# EAGLE design Ananas-core-0.9.2 (EAGLE 7.2.0)
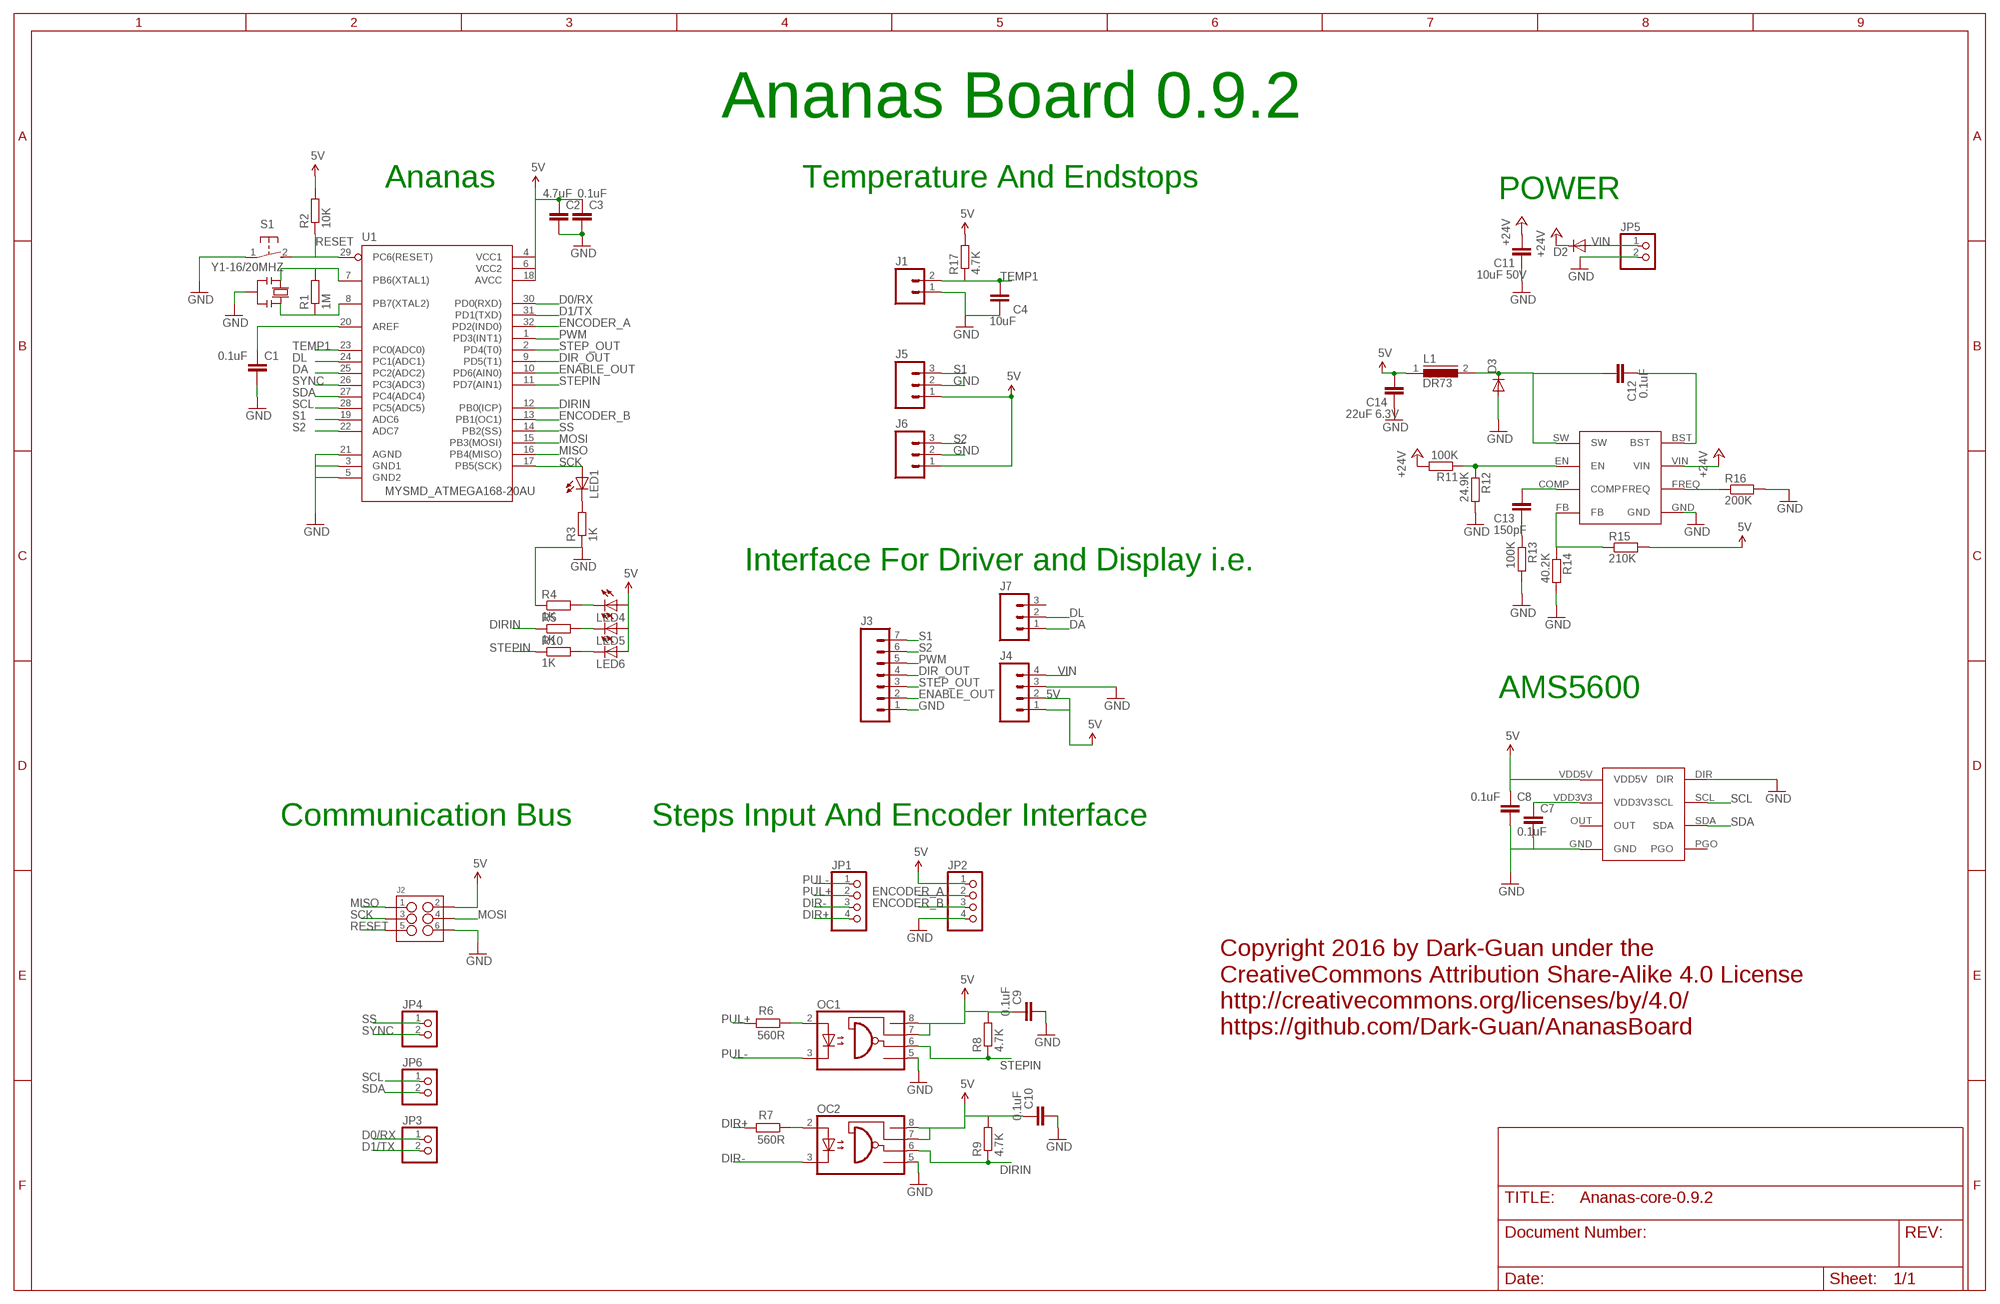
[diagram p0: schematic, sheet 1]

## Parts
C1  0.1uF  C-EUC0603K  [C0603K]
C2  4.7uF  C-EUC0603K  [C0603K]
C3  0.1uF  C-EUC0603K  [C0603K]
C4  10uF  C-EUC0603K  [C0603K]
C7  0.1uF  C-EUC0603K  [C0603K]
C8  0.1uF  C-EUC0603K  [C0603K]
C9  0.1uF  C-EUC0603K  [C0603K]
C10  0.1uF  C-EUC0603K  [C0603K]
C11  10uF 50V  C-EUC0805  [C0805]
C12  0.1uF  C-EUC0603K  [C0603K]
C13  150pF  C-EUC0603K  [C0603K]
C14  22uF 6.3V  C-EUC0805  [C0805]
D2  DIODE_DIODE-SMB  [DIODE_SMB]
D3  DIODE_DIODE-SMB  [DIODE_SMB]
J1  M02PTH  [1X02]
J2  M03X2NO_SILK  [2X3-NS]
J3  M07  [1X07]
J4  M04PTH  [1X04]
J5  M03PTH  [1X03]
J6  M03PTH  [1X03]
J7  M03PTH  [1X03]
JP1  PINHD-1X4/OCT  [1X04/OCT]
JP2  PINHD-1X4/OCT  [1X04/OCT]
JP3  PINHD-1X2/OCT  [1X02/OCT]
JP4  PINHD-1X2/OCT  [1X02/OCT]
JP5  PINHD-1X2/OCT  [1X02/OCT]
JP6  PINHD-1X2/OCT  [1X02/OCT]
L1  DR73  [DR73]
LED1  LEDCHIPLED_0603  [CHIPLED_0603]
LED4  LEDCHIPLED_0603  [CHIPLED_0603]
LED5  LEDCHIPLED_0603  [CHIPLED_0603]
LED6  LEDCHIPLED_0603  [CHIPLED_0603]
MP1854  MP1584  [MP1584]
OC1  OPTOCOUPLER_(2)_HCPL0600  [OPTOCOUPLER_(2)_SOIC08]
OC2  OPTOCOUPLER_(2)_HCPL0600  [OPTOCOUPLER_(2)_SOIC08]
R1  1M  R-EU_R0603  [R0603]
R2  10K  R-EU_R0603  [R0603]
R3  1K  R-EU_R0603  [R0603]
R4  1K  R-EU_R0603  [R0603]
R5  1K  R-EU_R0603  [R0603]
R6  560R  R-EU_R0603  [R0603]
R7  560R  R-EU_R0603  [R0603]
R8  4.7K  R-EU_R0603  [R0603]
R9  4.7K  R-EU_R0603  [R0603]
R10  1K  R-EU_R0603  [R0603]
R11  100K  R-EU_R0603  [R0603]
R12  24.9K  R-EU_R0603  [R0603]
R13  100K  R-EU_R0603  [R0603]
R14  40.2K  R-EU_R0603  [R0603]
R15  210K  R-EU_R0603  [R0603]
R16  200K  R-EU_R0603  [R0603]
R17  4.7K  R-EU_R0603  [R0603]
S1  31-XX  [B3F-31XX]
U1  MYSMD_ATMEGA168-20AU  [MYSMD_QFP032]
U$1  ARDUINO_AS5600  [ARDUINO_AS5600]
Y1-16/20MHZ  MYSMD2_RESONATORMU  [MYSMD2_RESONATOR]

## Nets
5V: C2.1 C3.1 C8.1 C9.1 C10.1 C14.2 J2.2 J4.1 J4.2 J5.1 J6.1 JP2.1 L1.1 LED4.A LED5.A LED6.A OC1.7(VE) OC1.8(VCC) OC2.7(VE) OC2.8(VCC) R2.2 R8.2 R9.2 R15.2 R17.2 U1.4(VCC1) U1.6(VCC2) U1.18(AVCC) U$1.VDD5V
+24V: C11.2 D2.C MP1854.VIN R11.2
D0/RX: JP3.1 U1.30(PD0(RXD))
D1/TX: JP3.2 U1.31(PD1(TXD))
DA: J7.1 U1.25(PC2(ADC2))
DIR+: JP1.4 R7.2
DIR-: JP1.3 OC2.3(C)
DIR_OUT: J3.4 U1.9(PD5(T1))
DIRIN: OC2.6(VO) R5.1 R9.1 U1.12(PB0(ICP))
DL: J7.2 U1.24(PC1(ADC1))
ENABLE_OUT: J3.2 U1.10(PD6(AIN0))
ENCODER_A: JP2.2 U1.32(PD2(IND0))
ENCODER_B: JP2.3 U1.13(PB1(OC1))
GND: C1.2 C2.2 C3.2 C4.1 C7.2 C8.2 C9.2 C10.2 C11.1 C14.1 D3.A J1.1 J2.6 J3.1 J4.3 J5.2 J6.2 JP2.4 JP5.2 MP1854.GND OC1.5(GND) OC2.5(GND) R3.1 R4.1 R12.2 R13.2 R14.2 R16.2 S1.1(P) U1.3(GND1) U1.5(GND2) U1.21(AGND) U$1.DIR U$1.GND Y1-16/20MHZ.2
MISO: J2.1 U1.16(PB4(MISO))
MOSI: J2.4 U1.15(PB3(MOSI))
N$3: R1.2 U1.7(PB6(XTAL1)) Y1-16/20MHZ.1
N$4: R1.1 U1.8(PB7(XTAL2)) Y1-16/20MHZ.3
N$7: C1.1 U1.20(AREF)
N$9: OC1.2(A) R6.1
N$10: LED1.C R3.2
N$11: OC2.2(A) R7.1
N$13: C13.1 R13.1
N$14: C7.1 U$1.VDD3V3
N$16: MP1854.FREQ R16.1
N$17: C12.1 MP1854.BST
N$18: C12.2 D3.C L1.2 MP1854.SW
N$19: MP1854.EN R11.1 R12.1
N$20: C13.2 MP1854.COMP
N$21: MP1854.FB R14.1 R15.1
N$25: LED4.C R4.2
N$26: LED5.C R5.2
N$27: LED6.C R10.2
PUL+: JP1.2 R6.2
PUL-: JP1.1 OC1.3(C)
PWM: J3.5 U1.1(PD3(INT1))
RESET: J2.5 R2.1 S1.2(S) U1.29(PC6(RESET))
S1: J3.7 J5.3 U1.19(ADC6)
S2: J3.6 J6.3 U1.22(ADC7)
SCK: J2.3 LED1.A U1.17(PB5(SCK))
SCL: JP6.1 U1.28(PC5(ADC5)) U$1.SCL
SDA: JP6.2 U1.27(PC4(ADC4)) U$1.SDA
SS: JP4.1 U1.14(PB2(SS))
STEP_OUT: J3.3 U1.2(PD4(T0))
STEPIN: OC1.6(VO) R8.1 R10.1 U1.11(PD7(AIN1))
SYNC: JP4.2 U1.26(PC3(ADC3))
TEMP1: C4.2 J1.2 R17.1 U1.23(PC0(ADC0))
VIN: D2.A J4.4 JP5.1
Unconnected: J7.3 U$1.OUT U$1.PGO

## Notes on the sheet
- Ananas Board 0.9.2
- Ananas | Temperature And Endstops
- POWER
- Interface For Driver and Display i.e.
- AMS5600
- Communication Bus | Steps Input And Encoder Interface
- Copyright 2016 by Dark-Guan under the
  CreativeCommons Attribution Share-Alike 4.0 License
  http://creativecommons.org/licenses/by/4.0/
  https://github.com/Dark-Guan/AnanasBoard

## Library data of the parts
C1-C4 C7-C14 = resistor:C-EU: CAPACITOR, European symbol
D2 D3 = Arduino_MEGA2560_ref:DIODE_DIODE-: DIODE
J1 = SparkFun-Connectors:M02: Standard 2-pin 0.1" header. Use with - straight break away headers ( PRT-00116) - right angle break away headers (PRT-00553) - swiss pins (PRT-00743) - machine pins (PRT-00117) - female headers (PRT-00115) Molex polarized connector foot print use with: PRT-08233 with associated crimp pins and housings. 2.54_SCREWTERM for use with PRT-10571. 3.5mm Screw Terminal footprints for PRT-08084 5mm Screw Terminal footprints for use with PRT-08432
J2 = SparkFun-Connectors:M03X2: 2x3 .1" header. Shrouded, with keying- CONN-10681 SMT- CONN-11415 Pogo pins- HW-11044
J3 = SparkFun-Connectors:M07: Header 7 Standard 7-pin 0.1" header. Use with straight break away headers (SKU : PRT-00116), right angle break away headers (PRT-00553), swiss pins (PRT-00743), machine pins (PRT-00117), and female headers (PRT-00115). NOTES ON THE VARIANTS LOCK and LOCK_LONGPADS... This footprint was designed to help hold the alignment of a through-hole component (i.e. 7-pin header) while soldering it into place. You may notice that each hole has been shifted either up or down by 0.005 of an inch from it's more standard position (which is usually a perfectly straight line). This slight alteration caused the pins (the squares in the middle) to touch the edges of the holes. Because they are alternating, it causes a "brace" to hold the header in place. 0.005 has proven to be the perfect amount of "off-center" position when using our standard breakaway headers. Although looks a little odd when you look at the bare footprint, once you have a header in there, the alteration is very hard to notice. Also, if you push a header all the way into place, it is covered up entirely on the bottom side. This idea of altering the position of holes to aid alignment will be further integrated into the Sparkfun Library for other footprints. It can help hold any component with 3 or more connection pins.
J4 = SparkFun-Connectors:M04: Header 4 Standard 4-pin 0.1" header. Use with straight break away headers (SKU : PRT-00116), right angle break away headers (PRT-00553), swiss pins (PRT-00743), machine pins (PRT-00117), and female headers (PRT-00115). Molex polarized connector foot print use with SKU : PRT-08231 with associated crimp pins and housings. 1MM SMD Version SKU: PRT-10208; PROD_ID: CONN-09696
J5-J7 = SparkFun-Connectors:M03: Header 3 Standard 3-pin 0.1" header. Use with straight break away headers (SKU : PRT-00116), right angle break away headers (PRT-00553), swiss pins (PRT-00743), machine pins (PRT-00117), and female headers (PRT-00115). Molex polarized connector foot print use with SKU : PRT-08232 with associated crimp pins and housings.
JP1 JP2 = pinhead_v2:PINHD-1X4: PIN HEADER
JP3-JP6 = pinhead_v2:PINHD-1X2: PIN HEADER
L1 = inductors:DR73: High Power Density, High Efficiency, Shielded Inductors Source: coiltronics_dr_series.pdf
LED1 LED4-LED6 = led:LED: LED OSRAM: - CHIPLED LG R971, LG N971, LY N971, LG Q971, LY Q971, LO R971, LY R971 LH N974, LH R974 LS Q976, LO Q976, LY Q976 LO Q996 - Hyper CHIPLED LW Q18S LB Q993, LB Q99A, LB R99A - SideLED LS A670, LO A670, LY A670, LG A670, LP A670 LB A673, LV A673, LT A673, LW A673 LH A674 LY A675 LS A676, LA A676, LO A676, LY A676, LW A676 LS A679, LY A679, LG A679 - Hyper Micro SIDELED? LS Y876, LA Y876, LO Y876, LY Y876 LT Y87S - SmartLED LW L88C, LW L88S LB L89C, LB L89S, LG L890 LS L89K, LO L89K, LY L89K LS L896, LA L896, LO L896, LY L896 - TOPLED LS T670, LO T670, LY T670, LG T670, LP T670 LSG T670, LSP T670, LSY T670, LOP T670, LYG T670 LG T671, LOG T671, LSG T671 LB T673, LV T673, LT T673, LW T673 LH T674 LS T676, LA T676, LO T676, LY T676, LB T676, LH T676, LSB T676, LW T676 LB T67C, LV T67C, LT T67C, LS T67K, LO T67K, LY T67K, LW E67C LS E67B, LA E67B, LO E67B, LY E67B, LB E67C, LV E67C, LT E67C LW T67C LS T679, LY T679, LG T679 LS T770, LO T770, LY T770, LG T770, LP T770 LB T773, LV T773, LT T773, LW T773 LH T774 LS E675, LA E675, LY E675, LS T675 LS T776, LA T776, LO T776, LY T776, LB T776 LHGB T686 LT T68C, LB T68C - Hyper Mini TOPLED? LB M676 - Mini TOPLED Santana? LG M470 LS M47K, LO M47K, LY M47K Source: http://www.osram.convergy.de LUXEON: - LUMILED? LXK2-PW12-R00, LXK2-PW12-S00, LXK2-PW14-U00, LXK2-PW14-V00 LXK2-PM12-R00, LXK2-PM12-S00, LXK2-PM14-U00 LXK2-PE12-Q00, LXK2-PE12-R00, LXK2-PE12-S00, LXK2-PE14-T00, LXK2-PE14-U00 LXK2-PB12-K00, LXK2-PB12-L00, LXK2-PB12-M00, LXK2-PB14-N00, LXK2-PB14-P00, LXK2-PB14-Q00 LXK2-PR12-L00, LXK2-PR12-M00, LXK2-PR14-Q00, LXK2-PR14-R00 LXK2-PD12-Q00, LXK2-PD12-R00, LXK2-PD12-S00 LXK2-PH12-R00, LXK2-PH12-S00 LXK2-PL12-P00, LXK2-PL12-Q00, LXK2-PL12-R00 Source: www.luxeon.com KINGBRIGHT: KA-3528ASYC Source: www.kingbright.com
MP1854 = MP1584:MP1584
OC1 OC2 = Ananas-main:OPTOCOUPLER_(2)_HCPL0600: HEWLETT PACKARD OPTO COUPLER
R1-R17 = resistor:R-EU_: RESISTOR, European symbol
S1 = switch-omron:31-XX: OMRON SWITCH; MPN: B3F-3100; OC_FARNELL: 959704; OC_NEWARK: 36M3582
U1 = Arduino_Nano2:MYSMD_ATMEGA168-20AU
U$1 = Ananas-main:ARDUINO_AS5600
Y1-16/20MHZ = Arduino_Nano2:MYSMD2_RESONATOR

## Board
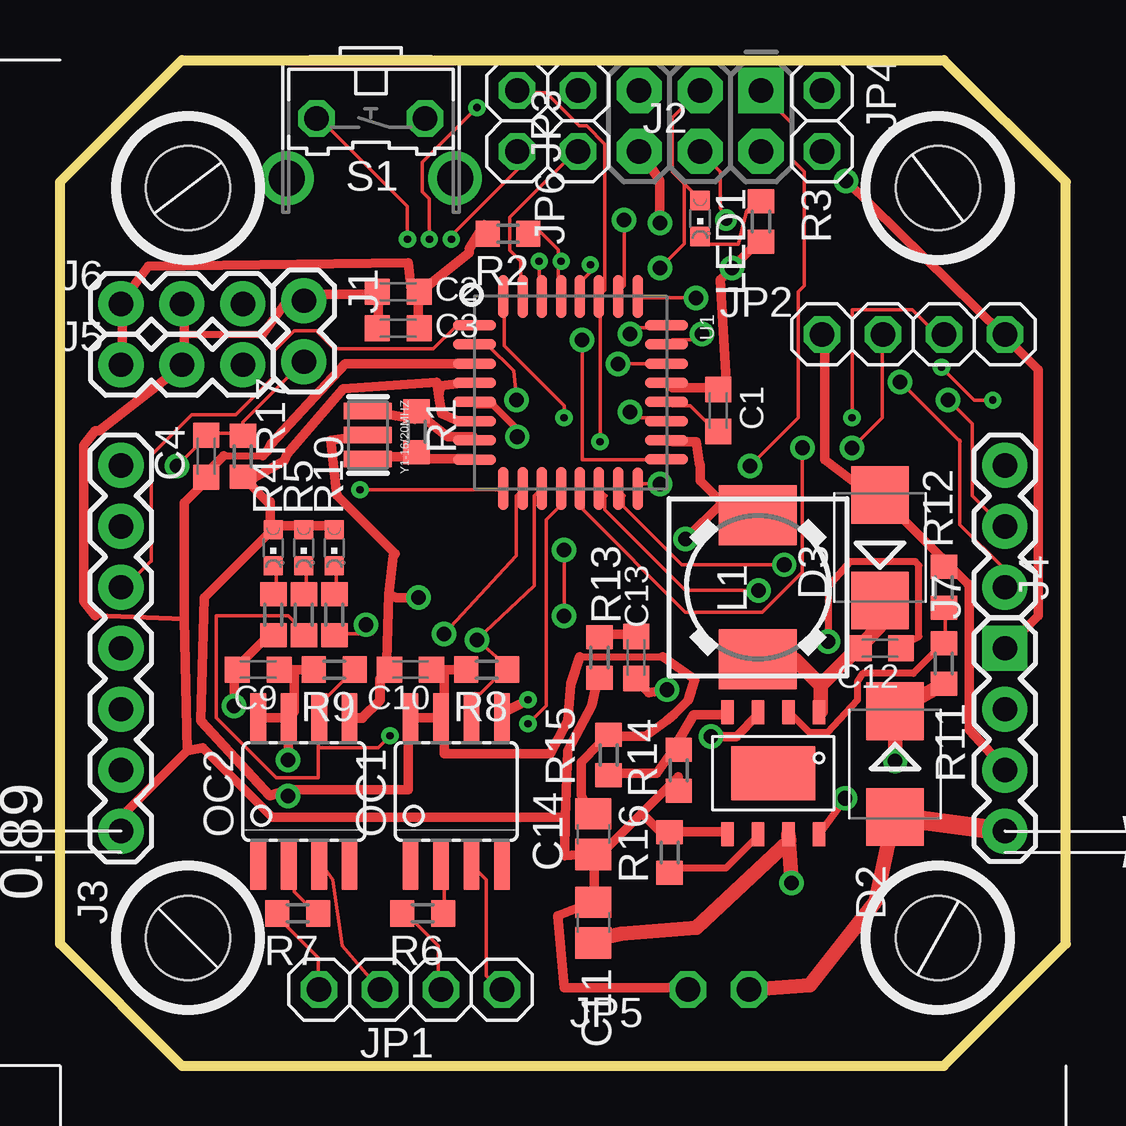
[diagram p1: board, top side]
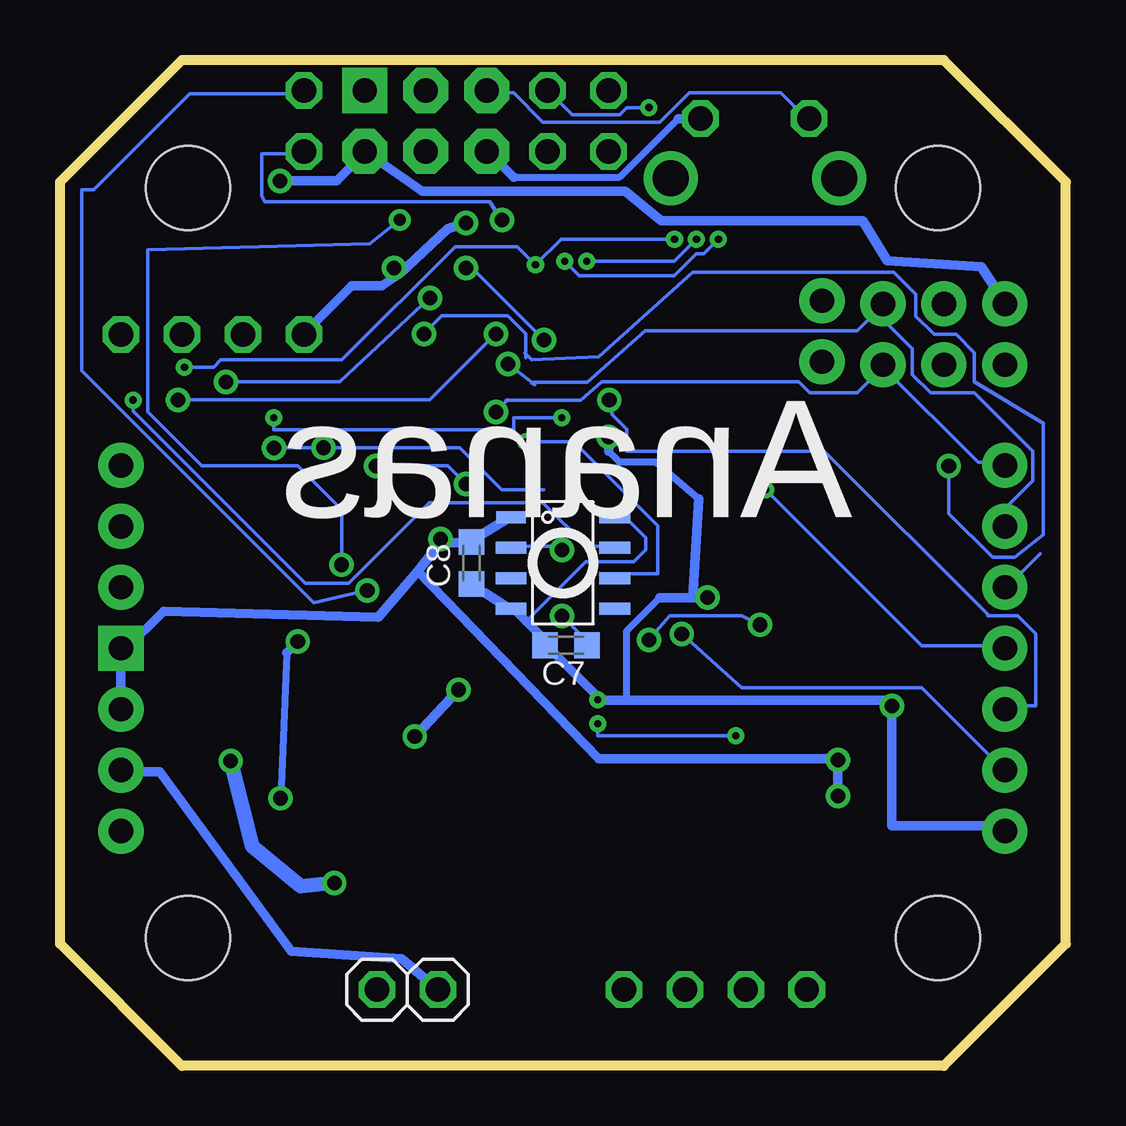
[diagram p2: board, bottom side, seen from below]

Size 41.91 x 41.91 mm. Coordinates in mm from the lower left corner, seen from the top.
Outline: 5.08,0 0,5.08 0,36.83 5.08,41.91 36.83,41.91 41.91,36.83 41.91,5.08 36.83,0 5.08,0
Copper layers (1*16): Top 0.035mm / dielectric 1.5mm / Bottom 0.035mm
Design rules "dark-2-lays-6mil": minimum track width 6mil, minimum drill 12mil, track to track 6mil, track to pad 6mil, pad to pad 6mil, via to via 6mil, smd to smd 6mil, copper to edge 20mil, drill to drill 8mil, minimum pad ring 10mil, minimum via ring 8mil, stop-mask expansion 4mil, vias tented up to drill 0mil, thermal gap 6mil
Holes 3.5 mm at 5.33,36.58 36.58,36.58 5.33,5.33 36.58,5.33

### Footprints (pad centres in the part's own frame; a part is rotated, then mirrored left to right if it is on the bottom)
C0603K = smd 1.05 x 1.08: 1 -0.875,0; 2 0.875,0
C0805 = smd 1.3 x 1.5: 1 -0.85,0; 2 0.85,0
DIODE_SMB = smd 2.4 x 2.4: A 2.2,0; C -2.2,0
1X02 = drill 1.016 pad 1.88: 1 0,0; 2 2.54,0
2X3-NS = drill 1.016 pad 1.88 square: 1 -2.54,-1.27 | drill 1.016 pad 1.88 octagon: 2 -2.54,1.27; 3 0,-1.27; 4 0,1.27; 5 2.54,-1.27; 6 2.54,1.27
1X07 = drill 1.016 pad 1.88: 1 0,0; 2 2.54,0; 3 5.08,0; 4 7.62,0; 5 10.16,0; 6 12.7,0; 7 15.24,0
1X04 = drill 1.016 pad 1.88 square: 1 0,0 | drill 1.016 pad 1.88: 2 2.54,0; 3 5.08,0; 4 7.62,0
1X03 = drill 1.016 pad 1.88: 1 0,0; 2 2.54,0; 3 5.08,0
1X04/OCT = drill 1.016 octagon: 1 -3.81,0; 2 -1.27,0; 3 1.27,0; 4 3.81,0
1X02/OCT = drill 1.016 octagon: 1 -1.27,0; 2 1.27,0
DR73 = smd 2.5 x 3.25: 1 -3,0; 2 3,0
CHIPLED_0603 = smd 0.8 x 0.8: A 0,-0.75; C 0,0.75
MP1584 = smd 1.016 x 0.508: BST 3.81,4.445; COMP -1.27,1.905; EN -1.27,3.175; FB -1.27,0.635; FREQ 3.81,1.905; GND 3.81,0.635; SW -1.27,4.445; VIN 3.81,3.175 | smd 2.26 x 3.51: P$1 1.27,2.54
OPTOCOUPLER_(2)_SOIC08 = smd 0.66 x 2.032: 1 -1.905,-3.073; 2 -0.635,-3.073; 3 0.635,-3.073; 4 1.905,-3.073; 5 1.905,3.073; 6 0.635,3.073; 7 -0.635,3.073; 8 -1.905,3.073
R0603 = smd 1 x 1.1: 1 -0.85,0; 2 0.85,0
B3F-31XX = drill 1.016 octagon: 1 -2.261,-1.245; 2 2.261,-1.245 | drill 1.499 pad 2.159: 3 -3.505,1.245; 4 3.505,1.245
MYSMD_QFP032 = smd 0.432 x 1.778: 1 0,0; 2 0.8,0; 3 1.599,0; 4 2.399,0; 5 3.199,0; 6 3.998,0; 7 4.798,0; 8 5.598,0; 17 5.588,8.001; 18 4.798,7.997; 19 3.998,7.997; 20 3.199,7.997; 21 2.399,7.997; 22 1.599,7.997; 23 0.799,7.997; 24 0,7.997 | smd 1.778 x 0.432: 9 6.807,1.194; 10 6.807,2.007; 11 6.807,2.794; 12 6.807,3.607; 13 6.807,4.394; 14 6.807,5.182; 15 6.807,5.994; 16 6.816,6.803; 25 -1.194,6.807; 26 -1.194,5.994; 27 -1.194,5.182; 28 -1.194,4.394; 29 -1.194,3.607; 30 -1.194,2.794; 31 -1.194,2.007; 32 -1.194,1.194
ARDUINO_AS5600 = smd 1.28 x 0.508: DIR 3.429,4.445; GND -0.889,0.635; OUT -0.889,1.905; PGO 3.429,0.635; SCL 3.429,3.175; SDA 3.429,1.905; VDD3V3 -0.889,3.175; VDD5V -0.889,4.445
MYSMD2_RESONATOR = smd 0.7 x 2: 1 -1,0; 2 0,0; 3 1,0

### Placement (x,y rotation side)
C1  27.43,27.3 90 top
C2  14.1,32.26 180 top
C3  14.1,30.73 180 top
C4  6.1,25.4 90 top
C7  20.83,17.53 180 bottom
C8  24.77,20.95 270 bottom
C9  8.26,16.51 180 top
C10  14.61,16.51 180 top
C11  22.23,5.97 270 top
C12  34.16,17.4 180 top
C13  24,17.02 270 top
C14  22.23,9.65 90 top
D2  34.8,12.57 270 top
D3  34.16,21.59 90 top
J1  10.16,31.88 270 top
J2  26.67,39.37 180 top
J3  2.54,9.78 90 top
J4  39.37,17.4 270 top
J5  2.54,29.21 0 top
J6  2.54,31.75 0 top
J7  39.37,19.94 90 top
JP1  14.61,3.17 180 top
JP2  35.56,30.48 180 top
JP3  21.59,39.37 270 top
JP4  31.75,39.37 270 top
JP5  27.43,3.17 0 bottom
JP6  19.05,39.37 90 top
L1  29.08,19.94 270 top
LED1  26.67,35.31 180 top
LED4  8.89,21.59 180 top
LED5  10.16,21.59 180 top
LED6  11.43,21.59 180 top
MP1854  27.18,13.46 270 top
OC1  16.51,11.43 0 top
OC2  10.16,11.43 0 top
R1  14.86,26.42 90 top
R2  18.67,34.67 180 top
R3  29.21,35.18 90 top
R4  8.89,18.8 90 top
R5  10.16,18.8 90 top
R6  15.11,6.35 180 top
R7  9.91,6.35 180 top
R8  17.78,16.51 180 top
R9  11.43,16.51 180 top
R10  11.43,18.8 90 top
R11  36.83,16.76 270 top
R12  36.83,19.94 90 top
R13  22.48,17.02 270 top
R14  25.78,12.32 270 top
R15  22.86,12.95 90 top
R16  25.4,8.89 90 top
R17  7.62,25.4 270 top
S1  12.95,38.23 180 top
U1  17.27,30.86 270 top
U$1  22.23,18.41 0 bottom
Y1-16/20MHZ  12.83,26.29 270 top

### Tracks (layer width: path | path; a pad name or v marks a point on that pad's centre or on a via)
5V  (via drill 0.61)
  Top 0.3: 21.67,17.04 25.12,17.04
  Top 0.4: J4.1 39.5,17.5 40.75,18.75 40.75,29 39.5,30.25 JP2.1 39.25,30.5 v32.75,36.87 | U1.18 25.5,26 26.5,26 26.63,25.14 26.67,24.99 26.67,24.38 27.58,23.47 | 9.75,16.5 10.5,16.5 R9.2 | 9.75,16.5 9.25,16.5 C9.1 | 9.75,16.5 9.75,14.75 OC2.7 9.5,14.5 | 9.5,14.5 8.5,14.5 OC2.8 | LED4.A 9,22.5 10,22.5 LED5.A 10.25,22.5 11.25,22.5 LED6.A | 8.75,23.47 8.75,22.5 LED4.A | 8.75,23.47 8.75,23.5 | 16,16.5 16.75,16.5 R8.2 | 16,16.5 15.5,16.5 C10.1 16,16.5 | 16,16.5 16,14.75 OC1.7 | OC1.7 15.75,14.5 14.75,14.5 OC1.8 14.5,14.5 14.5,11.5 9.5,11.5 | 16,13.01 16,14.5 OC1.7 | 16,13.01 16,13 | 9.5,11.5 8.75,11.25 5.87,14.37 6,19.5 8.75,22.25 LED4.A | v9.5,12.75 9.5,14.5 | 9.5,11.5 v9.5,11.25 | C14.2 22.1,10.52 21.72,11.28 21.72,12.65 22.48,13.41 22.73,13.84 R15.2 22.63,13.74 24.38,13.74 25.3,14.4 25.6,14.66 26.19,15.24 26.44,16.1 25.12,17.04 | 21.67,17.04 21.29,15.9 21.16,14.38 20.42,13.01 16,13.01 | 27.58,23.47 28.04,23.01 28.96,23.01 L1.1 27.58,23.47 | v26.06,21.95 27.58,23.47 | 8.75,23.47 8.69,23.47 7.62,24.54 R17.2 7.9,24.41 9.35,25.22 9.47,25.5 11.81,28.22 15.7,28.47 15.77,27.89 | 15.77,27.89 15.9,27.18 16.61,26.85 17.09,26.85 U1.6 | 15.77,27.89 15.85,28.35 17.09,28.47 U1.4 | C3.1 14.94,30.79 14.94,32.16 C2.1 | R2.2 17.68,35.05 17.04,34.04 17.04,33.88 15.09,32.31 C2.1 | C2.1 14.94,32.31 14.63,32.31 14.5,33.45 3.68,33.33 2.59,31.85 J6.1 2.59,31.7 2.59,29.26 J5.1
  Bottom 0.4: v9.5,11.25 v9.5,12.75 9.6,12.8 19.46,12.8 27,20.6 | v32.75,36.87 30.38,36.87 29.25,38 J2.2 29.11,37.95 28.96,37.95 26.82,36.45 18.36,36.45 16.87,35.2 8.46,35.2 7.44,33.55 3.53,33.3 2.59,31.85 J6.1 | J4.2 39.37,17.25 39.25,17.25 J4.1 39.17,17.37 37.59,18.95 28.65,18.69 27,20.6 | U$1.VDD5V 23.16,22.86 24.46,22.07 24.69,21.95 C8.1 24.84,21.79 26.06,21.79 | 27,20.6 26.06,21.79 | 26.06,21.79 v26.06,21.95
+24V  (via drill 0.6)
  Top 0.6: C11.2 22.25,5.25 23.39,5.5 26.5,5.75 30.38,9.37 MP1854.VIN v30.48,7.62 | R11.2 D2.C v34.8,12.7
  Bottom 0.6: v34.8,12.7 33.91,9.14 31.88,7.49 v30.48,7.62
D0/RX  (via drill 0.3)
  Top 0.152: v19.96,33.53 19.96,32.16 U1.30 | v15.39,34.44 15.39,36.12 15.09,36.42 15.09,37.64 v17.37,39.93
  Bottom 0.152: v19.96,33.53 16.31,33.53 v15.39,34.44 | v17.37,39.93 18.29,39.93 18.59,39.62 20.57,39.62 JP3.1
D1/TX
  Top 0.152: U1.31 19.2,32.16 19.2,33.53 18.75,33.98 18.75,35.36 21.49,38.1 JP3.2
DA  (via drill 0.61)
  Top 0.152: v26.5,32 24.25,32 U1.25 | 37.5,26 37.47,26.04 | 37.47,26.04 v35,28.5 | 39.25,20 J7.1 39.32,19.96 39.32,20.73 37.49,22.55 37.49,26.06 37.47,26.04
  Bottom 0.152: v26.5,32 30.25,28.5 v35,28.5
DIR+
  Top 0.152: R7.2 9,6.25 10.75,4.5 10.75,3.25 JP1.4
DIR-
  Top 0.152: OC2.3 11,8.25 11.37,7.75 11.75,5 13.25,3.25 JP1.3
DIR_OUT  (via drill 0.3)
  Top 0.152: v12.5,24 18.5,24 U1.9
  Bottom 0.152: v12.5,24 6,17.5 3,17.5 J3.4
DIRIN  (via drill 0.3)
  Top 0.152: 10.75,13.25 10.75,14.5 OC2.6 11,14.75 11,15.25 12.25,16.5 R9.1 | 10.75,13.25 10.75,12 9,12 6.5,14.5 6.5,18.75 9.5,18.75 9.75,18.5 9.75,18.25 10,18 R5.1 | 10.75,13.25 13.25,13.25 v13.75,13.75 | v19.5,14.25 20.25,15 20.25,22.75 20.75,23.25 20.75,24 U1.12
  Bottom 0.152: v13.75,13.75 19.5,13.75 v19.5,14.25
DL  (via drill 0.61)
  Top 0.152: v23.75,30.5 23.75,30.75 25.25,30.75 U1.24 | v37,27.75 38,26.75 38,23.75 39.25,22.5 J7.2
  Bottom 0.152: v23.75,30.5 26.5,27.75 v37,27.75
ENABLE_OUT  (via drill 0.61)
  Top 0.152: v16,18 19,21.25 19,23.75 19.25,24 U1.10
  Bottom 0.152: v16,18 13.5,15.75 6,15.75 2.75,12.5 J3.2
ENCODER_A  (via drill 0.3)
  Top 0.152: v21,27 21,27.5 18.5,30 18.5,32 U1.32 | v33,27 33,31.5 35.5,31.5 36.5,30.5 JP2.2
  Bottom 0.152: v21,27 23,27 23,26.5 33,26.5 v33,27
ENCODER_B  (via drill 0.61)
  Top 0.152: v33,25.75 34.25,27 34.25,30.25 JP2.3 | 21.75,24 U1.13 21.79,23.93 21.79,23.16 26.06,18.9 29.26,18.9 30.94,20.57 v30.94,25.76
  Bottom 0.152: 21.75,24 23.5,24 25.25,25.75 v30.94,25.75 | v33,25.75 v30.94,25.75 | v30.94,25.76 v30.94,25.75
GND  (via drill 0.3, 0.61)
  Top 0.152: 18.5,14.75 OC1.5
  Top 0.2: 5.18,18.62 1.47,18.75
  Top 0.3: 5.18,30.48 8.46,30.48 | 19.05,26.52 17.98,27.58 | 6.83,25.43 8.46,25.43
  Top 0.4: R4.1 8.75,18 7.5,16.75 C9.2 7.25,16.5 v7.25,15 | 13.7,19.64 13.88,21.25 13.97,21.34 11.53,23.77 11.28,26.06 12.01,26.16 Y1-16/20MHZ.2 | 13.7,19.64 13.62,16.88 C10.2 | U1.21 25.5,28.25 27.25,28.25 C1.2 27.75,28.5 27.5,32.75 v28,33.25 29,34.25 R3.1 | 34.25,23.75 D3.A | JP2.4 31.75,30.25 31.87,29.88 31.87,25.25 33.5,24 34,24 D3.A | v25,35.12 25,36.87 24.25,38 J2.6 | J4.3 39.25,12.5 37.88,14 37.88,20 37.8,20.12 37.19,20.73 36.88,20.73 R12.2 36.73,20.88 36.73,21.18 34.29,23.62 D3.A | 24.23,10.52 22.55,8.84 22.25,8.84 C14.1 | 24.23,10.52 25.76,12.04 R14.2 | 21.05,10.36 21.03,8.76 22.1,8.84 C14.1 | 21.05,10.36 21.16,13.13 22.15,15.01 22.4,16.15 R13.2 | 5.31,13.13 2.72,10.54 2.59,9.91 J3.1 | 5.31,13.13 5.18,18.62 5.18,23.47 6.1,24.38 C4.1 6.1,24.69 6.83,25.43 | C14.1 22.25,8.75 22.25,7 C11.1 22,6.75 20.75,6.26 21,3.25 25.96,3.25 JP5.2 | MP1854.GND 27.75,9.75 25.5,9.75 R16.2 25.25,9.75 25,9.75 24.23,10.52 | 5.31,13.13 5.94,13.26 8.84,10.36 20.88,10.36 21.05,10.36 | v14.94,19.51 14.02,19.51 13.7,19.64 | C3.2 13.26,30.79 13.26,32.16 C2.2 13.11,32.16 10.36,32.16 10.21,32 J1.1 10.06,31.85 9.45,31.85 8.46,30.48 | J6.2 5.18,31.7 5.18,30.48 5.18,29.26 J5.2 5.03,29.11 1.63,26.47 1.47,26.47 0.99,25.86 0.99,19.36 1.47,18.75 | 17.98,27.58 17.37,27.58 U1.5 | v19.05,26.21 19.05,26.52 | 8.46,25.43 8.66,25.63 8.79,25.91 11.89,29.26 17.22,29.26 U1.3
  Top 0.406: OC2.5 12.6,14.5 13.34,15.24 13.34,16.11 C10.2 | 18.5,14.75 v19.5,15.25
  Bottom 0.152: v19.5,15.25 19.36,15.24 | U$1.DIR 18.5,23 17.5,22 17.5,21.5 18,21 20,21 22.48,18.52 22.5,18.5
  Bottom 0.3: 16.92,19.51 18.29,18.14 18.29,15.24 | 19.05,25.6 18.59,25.15 17.07,25.15 15.29,23.62 | 16.15,39.47 18.59,37.03 23.01,37.03
  Bottom 0.4: J3.1 2.75,10 7.25,10 v7.25,15 7.32,15.09 7.47,15.24 18.29,15.24 19.36,15.24 21.64,17.53 C7.2 21.79,17.53 21.79,17.83 22.48,18.52 23.01,19.05 U$1.GND 23.16,19.05 24.21,19.71 24.69,19.96 C8.2 | J4.3 39.25,12.25 37.75,12.25 32.28,4.78 27.66,4.47 JP5.2 | 27.75,33 28.5,32.5 29.75,32.5 31.75,30.5 JP2.4 | 27.75,33 25.75,34.87 v25,35.12 | 27.75,33 v28,33.25 | 16.92,19.51 15.54,19.51 | 15.54,19.51 v14.94,19.51 | 19.05,25.6 v19.05,26.21 | 15.54,19.51 15.29,23.62 | 16.15,39.47 S1.1 | 23.01,37.03 24.08,38.1 J2.6
MISO  (via drill 0.61)
  Top 0.152: v25,24.25 24.25,24.25 U1.16 | v28.75,25 30.75,27 30.75,32.25 31,32.5 31,37.25 30.5,37.75 30.5,39.25 29.25,40.5 J2.1
  Bottom 0.152: v25,24.25 25.75,25 v28.75,25
MOSI  (via drill 0.5, 0.61)
  Top 0.152: 23.5,23.75 23.25,24 U1.15 23.47,23.77 23.47,23.32 25.91,20.88 v30.18,20.88 | v27.75,35.25 27.5,35.75 27.5,37.25 26.75,38 J2.4
  Bottom 0.152: 32,25 36,25 38.25,27.25 38.25,34 29,34.25 v27.75,35.25 | 32,25 | v30.18,20.88 30.18,23.16 32,24.99 32,25
N$1
  pour Bottom: 27.81,35.43 27.94,35.43 27.81,35.18
N$3
  Top 0.152: 14.78,26.95 R1.2 14.94,27.18 | 12.65,27.33 Y1-16/20MHZ.1 | 17.22,26.21 U1.7
  Top 0.4: 12.65,27.33 14.78,26.95 | 17.22,26.21 16.15,26.21 14.94,27.18
N$4
  Top 0.152: 17.25,25.25 U1.8 17.22,25.3 | 15.39,25.3 14.94,25.76 R1.1 14.91,25.38 | 12.78,25.38 Y1-16/20MHZ.3
  Top 0.4: 15.39,25.3 17.22,25.3 | 12.78,25.38 14.91,25.38
N$7
  Top 0.152: C1.1 27.25,26.5 26.25,27.5 25.5,27.5 U1.20
N$9
  Top 0.152: R6.1 16,6.5 16,8.25 OC1.2
N$10
  Top 0.152: LED1.C 26.88,34.24 28.25,34.24 28.62,35.63 29,36 R3.2
N$11
  Top 0.152: R7.1 10.5,6.5 9.75,7.25 9.75,8.25 OC2.2
N$13
  Top 0.152: 23.93,17.98 C13.1 | 22.55,17.98 R13.1
  Top 0.4: 22.55,17.98 23.93,17.98
N$14  (via drill 0.61)
  Top 0.152: v21,21.5 v21,18.75
  Bottom 0.152: v21,18.75 20,17.75 C7.1 | U$1.VDD3V3 23.01,21.64 21.03,21.64 v21,21.5
N$16
  Top 0.152: 29,9.5 MP1854.FREQ | 25.5,8.25 R16.1
  Top 0.3: 29,9.5 27.75,8.25 25.5,8.25
N$17  (via drill 0.61)
  Top 0.152: 31.7,9.75 MP1854.BST | 35.05,17.53 C12.1
  Top 0.3: v32,17.68 32,19.96 32.92,21.01 35.64,21.01 35.79,20.85 35.79,17.88 35.05,17.53 | v32.72,11.15 31.7,9.75
  Bottom 0.3: 32.46,17.22 v32.72,11.15
  Bottom 0.4: v32,17.68 32.46,17.22
N$18
  Top 0.152: 31.7,14.78 MP1854.SW | 33.22,17.37 C12.2 33.38,17.53 | 34.14,18.29 34.14,19.36 D3.C | 30.63,16.92 29.11,16.92 L1.2
  Top 0.6: 31.7,15.85 31.7,14.78 | 33.22,17.37 31.7,15.85 | 33.38,17.53 34.14,18.29 | 31.7,15.85 30.63,16.92
N$19
  Top 0.152: 30.48,14.63 MP1854.EN | 36.73,17.53 R11.1 36.88,17.68 36.88,19.05 R12.1
  Top 0.3: 30.48,14.63 31.24,13.87 31.98,13.87 33.22,15.24 33.22,16 33.45,16.36 35.56,16.36 36.73,17.53
N$20  (via drill 0.61)
  Top 0.152: 29.08,14.63 MP1854.COMP | 24.08,16 C13.2
  Top 0.4: 29.08,14.63 28.17,13.72 v27.13,13.72 | v25.3,15.67 24.54,15.54 24.08,16
  Bottom 0.4: v25.3,15.67 v27.13,13.72
N$21
  Top 0.152: 27.74,14.63 MP1854.FB | 25.65,13.36 R14.1 25.76,13.46 | 22.63,12.19 R15.1
  Top 0.4: 27.74,14.63 26.42,14.63 25.65,13.36 | 22.63,12.19 24.87,12.19 25.76,13.46
N$25
  Top 0.152: LED4.C 9,20.75 9,19.75 R4.2
N$26
  Top 0.152: LED5.C 10.25,20.75 10.25,19.75 R5.2
N$27
  Top 0.152: LED6.C 11.5,20.75 11.5,19.75 R10.2
PUL+
  Top 0.152: R6.2 14.5,6.25 15.75,5 15.75,3.25 JP1.2
PUL-
  Top 0.152: OC1.3 17.25,8.25 17.75,7.75 17.75,3.75 18.25,3.25 JP1.1
PWM
  Top 0.152: J3.5 2.75,20 3.75,21 3.81,21.03 3.81,25.45 5.49,27.13 7.32,27.13 8.84,28.65 8.84,29.72 9.75,30.63 10.67,30.63 11.43,29.87 15.54,29.87 16.46,30.79 17.22,30.79 U1.1
  Bottom 0.152: 1.07,21.34 2.44,19.96 J3.5
RESET  (via drill 0.3)
  Top 0.152: 20.75,33.53 20.75,32.25 U1.29 | 20.75,33.53 20.75,34 19.75,35 R2.1 | v20.88,33.53 20.75,33.53 | v14.48,34.44 14.48,35.81 10.82,39.47 S1.2 | 20.73,33.53 20.75,33.53
  Bottom 0.152: v20.88,33.53 20.27,32.92 16.31,32.92 15.39,33.83 15.09,33.83 v14.48,34.44 | J2.5 24.08,40.54 23.01,40.54 21.79,39.32 16.92,39.32 15.7,40.54 11.89,40.54 10.82,39.47 S1.2
S1  (via drill 0.61)
  Top 0.152: v23.75,27.25 23.75,27 25.25,27 U1.19
  Bottom 0.152: 23.25,27.75 23.29,27.71 | 23.29,27.71 v23.75,27.25 | 23.29,27.71 23.32,27.74 20.22,27.74 19.33,28.5 11.12,28.5 10.67,28.04 8.69,28.04 7.62,29.11 | J3.7 2.59,25.15 3.66,25.15 7.62,29.11 | 7.62,29.11 J5.3
S2  (via drill 0.61)
  Top 0.152: v23.25,29.25 25.25,29.25 U1.22
  Bottom 0.152: 22.17,28.43 22.12,28.38 22.25,28.45 | 22.17,28.43 v23.25,29.25 | 2.5,22.5 J3.6 2.44,22.55 2.44,23.32 1.37,24.38 1.37,25.6 3.81,28.04 5.64,28.04 6.4,28.8 6.4,29.87 7.92,31.39 | 7.92,31.39 7.62,31.7 J6.3 7.92,31.39 | 7.92,31.39 8.69,30.63 17.53,30.63 19.94,28.47 22.25,28.47 22.17,28.43
SCK  (via drill 0.61)
  Top 0.152: 26,36.75 25.5,37.25 25.5,39.5 26.5,40.5 J2.3 | 26,36.75 26.5,36.25 LED1.A | v21.75,30.25 21.75,25.25 25.25,25.25 U1.17 | v25,33.25 26,34.25 26,36.75
  Bottom 0.152: v21.75,30.25 24.75,33.25 v25,33.25
SCL  (via drill 0.3)
  Top 0.152: v38.86,27.74 38.1,27.74 v36.73,29.11 | v22.1,33.38 22.1,33.07 21.79,32.77 21.79,32.16 U1.28 | JP6.1 19.05,37.34 16.31,34.59 v16.31,34.44
  Bottom 0.152: v38.86,27.74 38.86,27.28 31.7,20.12 29.87,20.12 26.52,23.47 21.79,23.47 19.96,21.64 18.9,21.64 U$1.SCL | v36.73,29.11 35.51,29.11 35.2,29.41 30.18,29.41 25.45,34.14 22.86,34.14 v22.1,33.38 21.03,34.44 v16.31,34.44
SDA  (via drill 0.3)
  Top 0.152: JP6.2 19.05,40.54 20.27,40.54 21.64,39.17 21.95,39.17 22.71,38.41 22.71,32.31 U1.27 22.5,32 v22.5,26
  Bottom 0.152: v22.5,26 20.5,26 17,22.5 17,20.5 18.5,20.5 U$1.SDA
SS  (via drill 0.61)
  Top 0.152: 22.75,23.75 22.72,23.78 | 22.72,23.78 22.5,24 U1.14 | v29.11,19.81 26.06,19.81 22.71,23.16 22.71,23.77 22.72,23.78
  Bottom 0.152: JP4.1 31.75,40.5 36.5,40.5 40.5,36.5 41,36.5 41,29 41,28.96 31.34,19.3 v29.11,19.81
STEP_OUT  (via drill 0.61)
  Top 0.152: v19.02,27.74 18.9,28.96 17.83,30.02 17.37,30.02 U1.2
  Bottom 0.152: 3.2,18.75 2,18.75 1.25,18 1.25,15 2.5,15 J3.3 | 3.2,18.75 3.25,18.75 | 3.2,18.75 10.06,25.6 18.29,25.6 18.29,26.52 18.9,27.13 v19.02,27.74
STEPIN  (via drill 0.61)
  Top 0.152: v12.75,18.38 13,18 11.5,18 R10.1 | U1.11 20,24 19.75,23.75 19.75,20 v17.37,17.75 18.5,16.75 R8.1 18.5,16.5 17.5,15.5 17.25,15.5 17.25,14.75 OC1.6
  Bottom 0.152: v12.75,18.38 13.5,18.75 16.5,18.75 v17.37,17.75
SYNC  (via drill 0.61)
  Top 0.152: v23.5,35.24 23.5,32.5 23.25,32.25 U1.26
  Bottom 0.152: v23.5,35.24 24,36 33.38,36 33.5,36.25 33.5,38 31.75,38 JP4.2
TEMP1  (via drill 0.61)
  Top 0.152: v26.75,30.5 26.75,30.25 25.5,30.25 U1.23 | 7.62,26.36 6.1,26.36 C4.2 6.1,26.21 v4.88,24.99 | 7.62,26.36 7.62,26.82 10.06,29.26 J1.2 | 7.62,26.36 R17.1
  Bottom 0.152: v26.75,30.5 26,31.25 23.25,31.25 22.5,30.5 22.5,29.72 | 22.5,29.5 22.5,29.72 | 22.5,29.72 22.55,29.72 22.25,29.41 19.46,29.54 15.54,33.07 7.16,33.07 6.25,32.16 6.25,31.24 5.49,30.48 4.57,30.48 3.81,29.72 3.81,28.5 0.94,26.77 0.94,22.12 2.13,21.18 3.05,21.18 4.88,23.01 v4.88,24.99
VIN
  Top 0.6: JP5.1 31.24,3.35 33.98,6.86 34.75,10.36 D2.A
  Top 0.813: J4.4 D2.A

### Text on the board
bNames: Ananas